# EAGLE design radio_expansion (EAGLE 7.7.0)
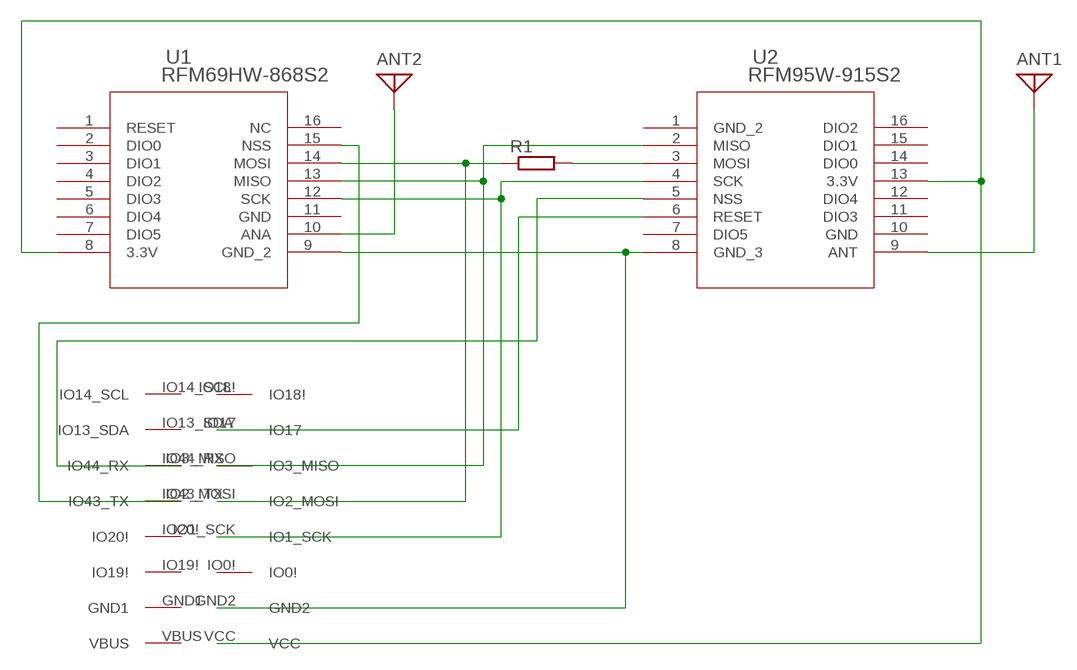
[diagram p0: schematic, sheet 1]

## Parts
ANT1  ANTENNA  [PAD-01]
ANT2  ANTENNA  [PAD-01]
R1  R-EU_M5923  [M5923]
U1  RFM69HW-868S2  [RFM69HW_S2_HRF]
U2  RFM95W-915S2  [IC16_RFM95W-915S2_RFS]
U$1  SOLARTERM_EXP  [CONN]

## Nets
GND: U1.9(GND_2) U2.8(GND_3) U$1.GND2
MISO: U1.13(MISO) U2.2(MISO) U$1.IO3_MISO
MOSI: R1.1 R1.2 U1.14(MOSI) U2.3(MOSI) U$1.IO2_MOSI
N$1: ANT2.1 U1.10(ANA)
N$2: ANT1.1 U2.9(ANT)
RESET: U2.6(RESET) U$1.IO17
SCK: U1.12(SCK) U2.4(SCK) U$1.IO1_SCK
SEL69: U1.15(NSS) U$1.IO43_TX
SEL95: U2.5(NSS) U$1.IO44_RX
VCC: U1.8(3.3V) U2.13(3.3V) U$1.VCC
Unconnected: U1.1(RESET) U1.2(DIO0) U1.3(DIO1) U1.4(DIO2) U1.5(DIO3) U1.6(DIO4) U1.7(DIO5) U1.11(GND) U1.16(NC) U2.1(GND_2) U2.7(DIO5) U2.10(GND) U2.11(DIO3) U2.12(DIO4) U2.14(DIO0) U2.15(DIO1) U2.16(DIO2) U$1.GND1 U$1.IO0! U$1.IO13_SDA U$1.IO14_SCL U$1.IO18! U$1.IO19! U$1.IO20! U$1.VBUS

## Library data of the parts
ANT1 ANT2 = discrete:ANTENNA: Antenna
R1 = rcl:R-EU_: RESISTOR, European symbol
U1 = RFM69:RFM69HW-868S2; COPYRIGHT: Copyright (C) 2026 Ultra Librarian. All rights reserved.; MANUFACTURER_NAME: HOPERF; MANUFACTURER_PART_NUMBER: RFM69HW-868S2
U2 = RFM95:RFM95W-915S2; COPYRIGHT: Copyright (C) 2026 Ultra Librarian. All rights reserved.; MANUFACTURER_NAME: RF Solutions; MANUFACTURER_PART_NUMBER: RFM95W-915S2
U$1 = solar_term:SOLARTERM_EXP

## Board
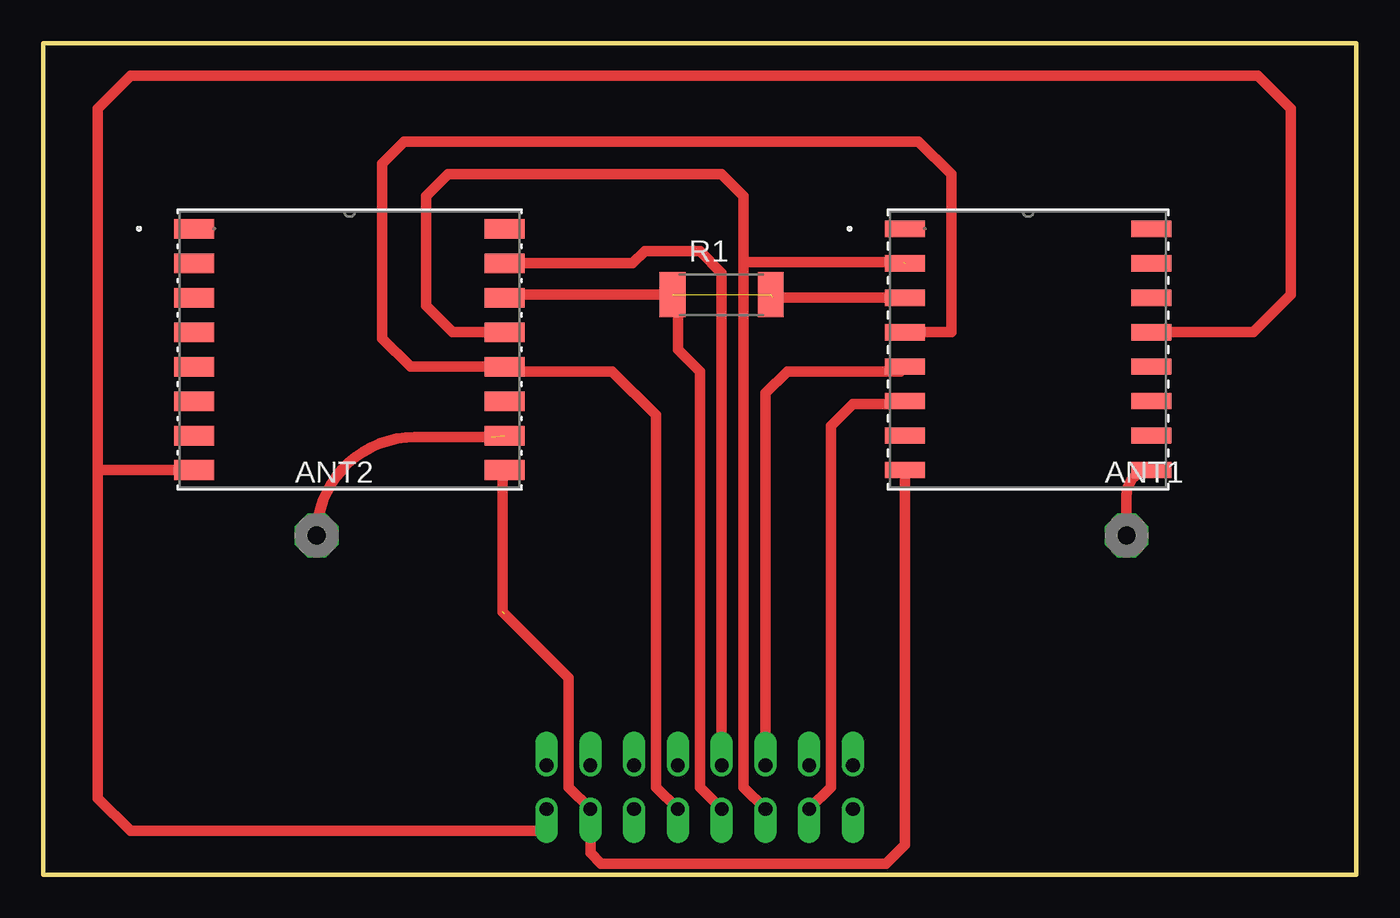
[diagram p1: board, top side]

Size 76.2 x 48.26 mm. Coordinates in mm from the lower left corner, seen from the top.
Outline: 0,48.26 76.2,48.26 76.2,0 0,0 0,48.26
Copper layers (1*16): Top 0.035mm / dielectric 1.5mm / Bottom 0.035mm
Design rules "default": minimum track width 10mil, minimum drill 24mil, track to track 8mil, track to pad 8mil, pad to pad 8mil, via to via 8mil, smd to smd 8mil, copper to edge 40mil, drill to drill 8mil, minimum pad ring 10mil, minimum via ring 8mil, stop-mask expansion 4mil, vias tented up to drill 0mil, thermal gap 10mil

### Footprints (pad centres in the part's own frame; a part is rotated, then mirrored left to right if it is on the bottom)
PAD-01 = drill 1.321 pad 2.54 octagon: 1 0,0
M5923 = smd 1.5 x 2.6: 1 -2.85,0; 2 2.85,0
RFM69HW_S2_HRF = smd 2.311 x 1.143: 1 -9.004,7; 2 -9.004,5; 3 -9.004,3; 4 -9.004,1; 5 -9.004,-1; 6 -9.004,-3; 7 -9.004,-5; 8 -9.004,-7; 9 9.004,-7; 10 9.004,-5; 11 9.004,-3; 12 9.004,-1; 13 9.004,1; 14 9.004,3; 15 9.004,5; 16 9.004,7
IC16_RFM95W-915S2_RFS = smd 2.311 x 0.94: 1 -7.15,7; 2 -7.15,5; 3 -7.15,3; 4 -7.15,1; 5 -7.15,-1; 6 -7.15,-3; 7 -7.15,-5; 8 -7.15,-7; 9 7.15,-7; 10 7.15,-5; 11 7.15,-3; 12 7.15,-1; 13 7.15,1; 14 7.15,3; 15 7.15,5; 16 7.15,7
CONN = drill 0.8 offset: GND1 -6.35,1.27; GND2 -6.35,-1.27; IO0! -3.81,-1.27; IO1_SCK -1.27,-1.27; IO2_MOSI 1.27,-1.27; IO3_MISO 3.81,-1.27; IO13_SDA 6.35,1.27; IO14_SCL 8.89,1.27; IO17 6.35,-1.27; IO18! 8.89,-1.27; IO19! -3.81,1.27; IO20! -1.27,1.27; IO43_TX 1.27,1.27; IO44_RX 3.81,1.27; VBUS -8.89,1.27; VCC -8.89,-1.27

### Placement (x,y rotation side)
ANT1  62.87,19.68 0 top
ANT2  15.88,19.68 0 top
R1  39.37,33.66 0 top
U1  17.78,30.48 0 top
U2  57.15,30.48 0 top
U$1  38.1,5.08 0 top

### Tracks (layer width: path | path; a pad name or v marks a point on that pad's centre or on a via)
GND  (1 unrouted)
  Top 0.61: 26.78,15.13 30.48,11.43 30.48,5.08 U$1.GND2 31.75,1.27 32.38,0.64 48.9,0.64 50,1.74 U2.8 | U1.9 26.67,23.37 26.67,15.24
MISO  (1 unrouted)
  Top 0.61: U$1.IO3_MISO 40.64,5.08 40.64,35.56 | 40.64,35.56 40.64,39.37 39.37,40.64 23.5,40.64 22.23,39.37 22.23,33.02 23.77,31.48 U1.13 | 40.64,35.56 49.92,35.56
MOSI  (2 unrouted)
  Top 0.61: U$1.IO2_MOSI 38.1,5.08 38.1,29.21 36.83,30.48 36.83,33.34 R1.1 26.96,33.66 U1.14 | U2.3 42.31,33.48
N$1  (1 unrouted)
  Top 0.61: ANT2.1 arc-90 21.59,25.4 26.04,25.4
N$2
  Top 0.61: U2.9 arc90 62.87,22.05 ANT1.1
RESET
  Top 0.61: U$1.IO17 45.72,5.08 45.72,26.04 46.99,27.3 49.83,27.3 U2.6
SCK
  Top 0.61: U$1.IO1_SCK 35.56,5.08 35.56,26.67 33.02,29.21 27.05,29.21 U1.12 21.32,29.48 19.68,31.11 19.68,41.27 20.95,42.55 50.8,42.55 52.7,40.64 52.7,31.48 U2.4
SEL69
  Top 0.61: U1.15 34.21,35.48 34.92,36.2 38.1,36.2 39.37,34.92 U$1.IO43_TX
SEL95
  Top 0.61: U$1.IO44_RX 41.91,27.94 43.18,29.21 49.73,29.21 U2.5
VCC
  Top 0.61: U$1.VCC 29.21,2.54 5.08,2.54 3.17,4.45 3.17,23.5 | U2.13 70.22,31.48 72.39,33.66 72.39,44.45 70.48,46.35 5.08,46.35 3.17,44.45 3.17,23.5 | 8.76,23.5 U1.8 3.19,23.48 3.17,23.5